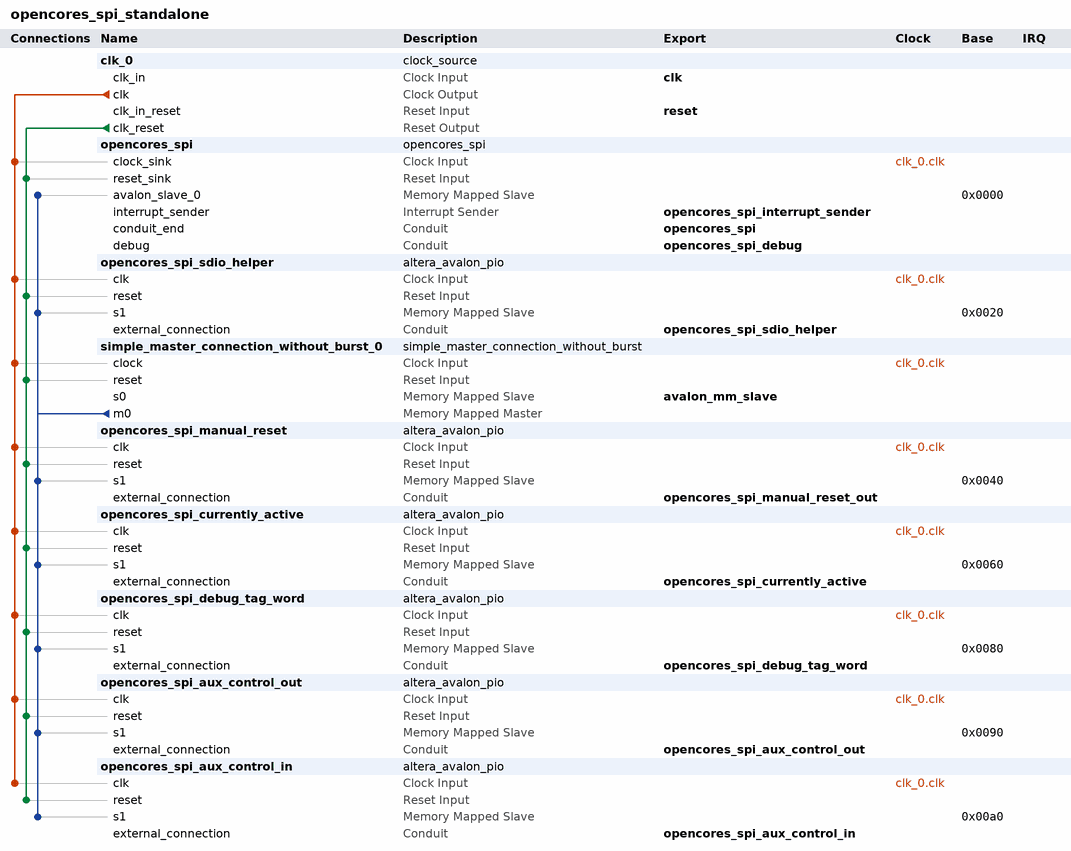
[diagram p0: system contents]
# Platform Designer (Qsys) system opencores_spi_standalone, Cyclone V 5CGXFC4C6F23C7
# Parameters at their usual value, and those the tool derives, are not listed.
package require -exact qsys 14.1
create_system opencores_spi_standalone
set_project_property DEVICE_FAMILY {Cyclone V}
set_project_property DEVICE 5CGXFC4C6F23C7

add_instance clk_0 clock_source 14.1
set_instance_parameter_value clk_0 clockFrequency 50000000
set_instance_parameter_value clk_0 resetSynchronousEdges BOTH

add_instance opencores_spi opencores_spi 1.0
set_instance_parameter_value opencores_spi Tp 1

add_instance opencores_spi_sdio_helper altera_avalon_pio 14.1
set_instance_parameter_value opencores_spi_sdio_helper bitModifyingOutReg true
set_instance_parameter_value opencores_spi_sdio_helper direction Output
set_instance_parameter_value opencores_spi_sdio_helper width 8

add_instance simple_master_connection_without_burst_0 simple_master_connection_without_burst 1.0

add_instance opencores_spi_manual_reset altera_avalon_pio 14.1
set_instance_parameter_value opencores_spi_manual_reset bitModifyingOutReg true
set_instance_parameter_value opencores_spi_manual_reset direction Output
set_instance_parameter_value opencores_spi_manual_reset width 8

add_instance opencores_spi_currently_active altera_avalon_pio 14.1
set_instance_parameter_value opencores_spi_currently_active bitModifyingOutReg true
set_instance_parameter_value opencores_spi_currently_active direction Output
set_instance_parameter_value opencores_spi_currently_active width 1

add_instance opencores_spi_debug_tag_word altera_avalon_pio 14.1
set_instance_parameter_value opencores_spi_debug_tag_word direction Output
set_instance_parameter_value opencores_spi_debug_tag_word width 8

add_instance opencores_spi_aux_control_out altera_avalon_pio 14.1
set_instance_parameter_value opencores_spi_aux_control_out direction Output
set_instance_parameter_value opencores_spi_aux_control_out width 32

add_instance opencores_spi_aux_control_in altera_avalon_pio 14.1
set_instance_parameter_value opencores_spi_aux_control_in direction Input
set_instance_parameter_value opencores_spi_aux_control_in width 32

# connections
add_connection clk_0.clk opencores_spi.clock_sink clock
add_connection clk_0.clk opencores_spi_aux_control_in.clk clock
add_connection clk_0.clk opencores_spi_aux_control_out.clk clock
add_connection clk_0.clk opencores_spi_currently_active.clk clock
add_connection clk_0.clk opencores_spi_debug_tag_word.clk clock
add_connection clk_0.clk opencores_spi_manual_reset.clk clock
add_connection clk_0.clk opencores_spi_sdio_helper.clk clock
add_connection clk_0.clk simple_master_connection_without_burst_0.clock clock
add_connection clk_0.clk_reset opencores_spi.reset_sink reset
add_connection clk_0.clk_reset opencores_spi_aux_control_in.reset reset
add_connection clk_0.clk_reset opencores_spi_aux_control_out.reset reset
add_connection clk_0.clk_reset opencores_spi_currently_active.reset reset
add_connection clk_0.clk_reset opencores_spi_debug_tag_word.reset reset
add_connection clk_0.clk_reset opencores_spi_manual_reset.reset reset
add_connection clk_0.clk_reset opencores_spi_sdio_helper.reset reset
add_connection clk_0.clk_reset simple_master_connection_without_burst_0.reset reset
add_connection simple_master_connection_without_burst_0.m0 opencores_spi.avalon_slave_0 avalon
set_connection_parameter_value simple_master_connection_without_burst_0.m0/opencores_spi.avalon_slave_0 baseAddress 0x0000
add_connection simple_master_connection_without_burst_0.m0 opencores_spi_aux_control_in.s1 avalon
set_connection_parameter_value simple_master_connection_without_burst_0.m0/opencores_spi_aux_control_in.s1 baseAddress 0x00a0
add_connection simple_master_connection_without_burst_0.m0 opencores_spi_aux_control_out.s1 avalon
set_connection_parameter_value simple_master_connection_without_burst_0.m0/opencores_spi_aux_control_out.s1 baseAddress 0x0090
add_connection simple_master_connection_without_burst_0.m0 opencores_spi_currently_active.s1 avalon
set_connection_parameter_value simple_master_connection_without_burst_0.m0/opencores_spi_currently_active.s1 baseAddress 0x0060
add_connection simple_master_connection_without_burst_0.m0 opencores_spi_debug_tag_word.s1 avalon
set_connection_parameter_value simple_master_connection_without_burst_0.m0/opencores_spi_debug_tag_word.s1 baseAddress 0x0080
add_connection simple_master_connection_without_burst_0.m0 opencores_spi_manual_reset.s1 avalon
set_connection_parameter_value simple_master_connection_without_burst_0.m0/opencores_spi_manual_reset.s1 baseAddress 0x0040
add_connection simple_master_connection_without_burst_0.m0 opencores_spi_sdio_helper.s1 avalon
set_connection_parameter_value simple_master_connection_without_burst_0.m0/opencores_spi_sdio_helper.s1 baseAddress 0x0020

# exported interfaces
add_interface avalon_mm_slave avalon slave
set_interface_property avalon_mm_slave EXPORT_OF simple_master_connection_without_burst_0.s0
add_interface clk clock sink
set_interface_property clk EXPORT_OF clk_0.clk_in
add_interface opencores_spi conduit end
set_interface_property opencores_spi EXPORT_OF opencores_spi.conduit_end
add_interface opencores_spi_aux_control_in conduit end
set_interface_property opencores_spi_aux_control_in EXPORT_OF opencores_spi_aux_control_in.external_connection
add_interface opencores_spi_aux_control_out conduit end
set_interface_property opencores_spi_aux_control_out EXPORT_OF opencores_spi_aux_control_out.external_connection
add_interface opencores_spi_currently_active conduit end
set_interface_property opencores_spi_currently_active EXPORT_OF opencores_spi_currently_active.external_connection
add_interface opencores_spi_debug conduit end
set_interface_property opencores_spi_debug EXPORT_OF opencores_spi.debug
add_interface opencores_spi_debug_tag_word conduit end
set_interface_property opencores_spi_debug_tag_word EXPORT_OF opencores_spi_debug_tag_word.external_connection
add_interface opencores_spi_interrupt_sender interrupt sender
set_interface_property opencores_spi_interrupt_sender EXPORT_OF opencores_spi.interrupt_sender
add_interface opencores_spi_manual_reset_out conduit end
set_interface_property opencores_spi_manual_reset_out EXPORT_OF opencores_spi_manual_reset.external_connection
add_interface opencores_spi_sdio_helper conduit end
set_interface_property opencores_spi_sdio_helper EXPORT_OF opencores_spi_sdio_helper.external_connection
add_interface reset reset sink
set_interface_property reset EXPORT_OF clk_0.clk_in_reset

set_interconnect_requirement {$system} qsys_mm.clockCrossingAdapter AUTO
set_interconnect_requirement {$system} qsys_mm.maxAdditionalLatency 2

save_system opencores_spi_standalone.qsys
